# Altium schematic sheet automotive-mirror-microcontroller-pin-names-3pt-numbers-4pt.SchDoc
size 117 x 96 mm
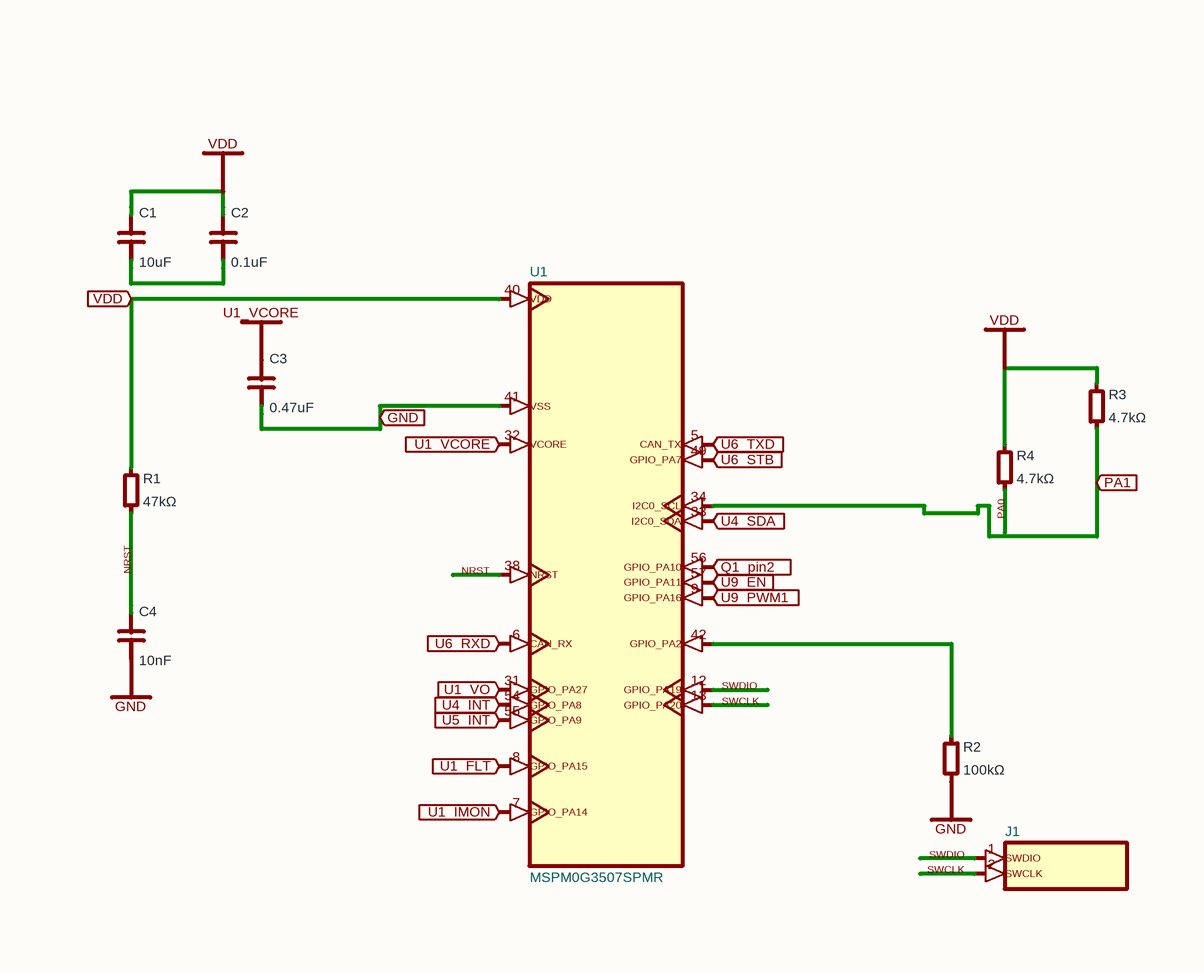
[diagram p0: automotive-mirror-microcontroller-pin-names-3pt-numbers-4pt.SchDoc]

## Parts
C1  10uF
C2  0.1uF
C3  0.47uF
C4  10nF
J1  (no value)
R1  47kΩ
R2  100kΩ
R3  4.7kΩ
R4  4.7kΩ
U1  (no value)

## Nets
GND: C3.2(cathode) C4.2(cathode) R2.2(cathode) U1.41(VSS)
U1_VCORE: C3.1(anode) U1.32(VCORE)
VDD: C1.1(anode) C2.1(anode) R1.2(cathode) R3.2(cathode) R4.2(cathode) U1.40(VDD)
PA1: R3.1(anode) U1.34(I2C0_SCL)
Q1_pin2: U1.56(GPIO_PA10)
U1_FLT: U1.8(GPIO_PA15)
U1_IMON: U1.7(GPIO_PA14)
U1_VO: U1.31(GPIO_PA27)
U4_INT: U1.54(GPIO_PA8)
U4_SDA: U1.33(I2C0_SDA)
U5_INT: U1.55(GPIO_PA9)
U6_RXD: U1.6(CAN_RX)
U6_STB: U1.49(GPIO_PA7)
U6_TXD: U1.5(CAN_TX)
U9_EN: U1.57(GPIO_PA11)
U9_PWM1: U1.9(GPIO_PA16)
NetC1_2: C1.2(cathode) C2.2(cathode)
NetC4_1: C4.1(anode) R1.1(anode)
NetR2_1: R2.1(anode) U1.42(GPIO_PA2)

Not connected (* = marked no-connect by the designer): J1 1(SWDIO) 2(SWCLK); R4 1(anode); U1 12(GPIO_PA19) 13(GPIO_PA20) 38(NRST)

## Notes on the sheet
- NRST
- (near U1) NRST
- (near R4) PA0
- (near U1) SWDIO
- (near U1) SWCLK
- (near J1) SWDIO
- (near J1) SWCLK
- (in symbol U1) MSPM0G3507SPMR

## Library data of the parts
C1-C4 = capacitor_down
J1 = J1
R1 R3 R4 = boxresistor_up
R2 = boxresistor_down
U1 = U1